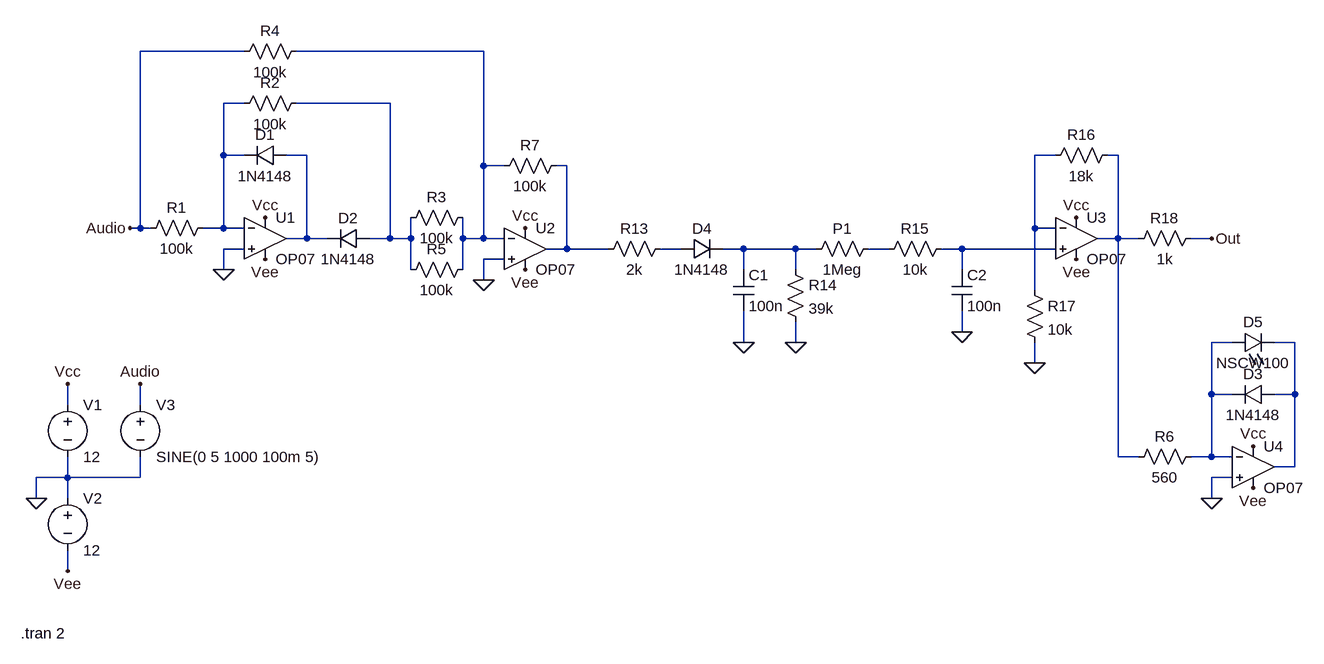
[diagram p0: schematic Envelope Follower.asc]
Envelope Follower.asc, the LTspice schematic file:
Version 4
SHEET 1 2524 680
WIRE 240 -480 80 -480
WIRE 608 -480 320 -480
WIRE 240 -400 208 -400
WIRE 464 -400 320 -400
WIRE 208 -320 208 -400
WIRE 240 -320 208 -320
WIRE 336 -320 304 -320
WIRE 1488 -320 1456 -320
WIRE 1584 -320 1568 -320
WIRE 608 -304 608 -480
WIRE 640 -304 608 -304
WIRE 736 -304 720 -304
WIRE 80 -208 80 -480
WIRE 80 -208 64 -208
WIRE 96 -208 80 -208
WIRE 208 -208 208 -320
WIRE 208 -208 176 -208
WIRE 240 -208 208 -208
WIRE 1456 -208 1456 -320
WIRE 1488 -208 1456 -208
WIRE 336 -192 336 -320
WIRE 336 -192 304 -192
WIRE 368 -192 336 -192
WIRE 464 -192 464 -400
WIRE 464 -192 432 -192
WIRE 496 -192 496 -224
WIRE 496 -192 464 -192
WIRE 576 -192 576 -224
WIRE 608 -192 608 -304
WIRE 608 -192 576 -192
WIRE 640 -192 608 -192
WIRE 1584 -192 1584 -320
WIRE 1584 -192 1552 -192
WIRE 1616 -192 1584 -192
WIRE 1728 -192 1696 -192
WIRE 240 -176 208 -176
WIRE 736 -176 736 -304
WIRE 736 -176 704 -176
WIRE 800 -176 736 -176
WIRE 912 -176 880 -176
WIRE 1008 -176 976 -176
WIRE 1088 -176 1008 -176
WIRE 1120 -176 1088 -176
WIRE 1232 -176 1200 -176
WIRE 1344 -176 1312 -176
WIRE 1488 -176 1344 -176
WIRE 640 -160 608 -160
WIRE 208 -144 208 -176
WIRE 496 -144 496 -192
WIRE 576 -144 576 -192
WIRE 1008 -144 1008 -176
WIRE 1088 -144 1088 -176
WIRE 1344 -144 1344 -176
WIRE 608 -128 608 -160
WIRE 1456 -112 1456 -208
WIRE 1344 -48 1344 -80
WIRE 1008 -32 1008 -80
WIRE 1088 -32 1088 -64
WIRE 1760 -32 1728 -32
WIRE 1856 -32 1824 -32
WIRE 1456 0 1456 -32
WIRE 1728 48 1728 -32
WIRE 1760 48 1728 48
WIRE 1856 48 1856 -32
WIRE 1856 48 1824 48
WIRE -32 64 -32 32
WIRE 80 64 80 32
WIRE 1584 144 1584 -192
WIRE 1616 144 1584 144
WIRE 1728 144 1728 48
WIRE 1728 144 1696 144
WIRE 1760 144 1728 144
WIRE 1856 160 1856 48
WIRE 1856 160 1824 160
WIRE -32 176 -32 144
WIRE -32 176 -80 176
WIRE 80 176 80 144
WIRE 80 176 -32 176
WIRE 1760 176 1728 176
WIRE -80 208 -80 176
WIRE -32 208 -32 176
WIRE 1728 208 1728 176
WIRE -32 320 -32 288
FLAG -32 320 Vee
FLAG -32 32 Vcc
FLAG -80 208 0
FLAG 80 32 Audio
FLAG 64 -208 Audio
FLAG 1728 -192 Out
FLAG 1008 -32 0
FLAG 1088 -32 0
FLAG 1520 -224 Vcc
FLAG 1520 -160 Vee
FLAG 1456 0 0
FLAG 272 -224 Vcc
FLAG 272 -160 Vee
FLAG 208 -144 0
FLAG 672 -208 Vcc
FLAG 672 -144 Vee
FLAG 608 -128 0
FLAG 1344 -48 0
FLAG 1792 128 Vcc
FLAG 1792 192 Vee
FLAG 1728 208 0
SYMBOL voltage -32 48 R0
SYMATTR InstName V1
SYMATTR Value 12
SYMBOL voltage -32 192 R0
SYMATTR InstName V2
SYMATTR Value 12
SYMBOL voltage 80 48 R0
WINDOW 123 0 0 Left 0
WINDOW 39 0 0 Left 0
SYMATTR InstName V3
SYMATTR Value SINE(0 5 1000 100m 5)
SYMBOL res 192 -224 R90
WINDOW 0 0 56 VBottom 2
WINDOW 3 32 56 VTop 2
SYMATTR InstName R1
SYMATTR Value 100k
SYMBOL res 896 -192 R90
WINDOW 0 0 56 VBottom 2
WINDOW 3 32 56 VTop 2
SYMATTR InstName R13
SYMATTR Value 2k
SYMBOL diode 912 -192 M90
WINDOW 0 0 32 VBottom 2
WINDOW 3 32 32 VTop 2
SYMATTR InstName D4
SYMATTR Value 1N4148
SYMBOL cap 992 -144 R0
SYMATTR InstName C1
SYMATTR Value 100n
SYMBOL res 1072 -160 R0
SYMATTR InstName R14
SYMATTR Value 39k
SYMBOL res 1216 -192 R90
WINDOW 0 0 56 VBottom 2
WINDOW 3 32 56 VTop 2
SYMATTR InstName P1
SYMATTR Value 1Meg
SYMBOL res 1328 -192 R90
WINDOW 0 0 56 VBottom 2
WINDOW 3 32 56 VTop 2
SYMATTR InstName R15
SYMATTR Value 10k
SYMBOL cap 1328 -144 R0
SYMATTR InstName C2
SYMATTR Value 100n
SYMBOL res 1584 -336 R90
WINDOW 0 0 56 VBottom 2
WINDOW 3 32 56 VTop 2
SYMATTR InstName R16
SYMATTR Value 18k
SYMBOL res 1440 -128 R0
SYMATTR InstName R17
SYMATTR Value 10k
SYMBOL res 1712 -208 R90
WINDOW 0 0 56 VBottom 2
WINDOW 3 32 56 VTop 2
SYMATTR InstName R18
SYMATTR Value 1k
SYMBOL diode 304 -304 M270
WINDOW 0 32 32 VTop 2
WINDOW 3 0 32 VBottom 2
SYMATTR InstName D1
SYMATTR Value 1N4148
SYMBOL res 336 -416 R90
WINDOW 0 0 56 VBottom 2
WINDOW 3 32 56 VTop 2
SYMATTR InstName R2
SYMATTR Value 100k
SYMBOL diode 432 -176 M270
WINDOW 0 32 32 VTop 2
WINDOW 3 0 32 VBottom 2
SYMATTR InstName D2
SYMATTR Value 1N4148
SYMBOL res 336 -496 R90
WINDOW 0 0 56 VBottom 2
WINDOW 3 32 56 VTop 2
SYMATTR InstName R4
SYMATTR Value 100k
SYMBOL res 592 -240 R90
WINDOW 0 0 56 VBottom 2
WINDOW 3 32 56 VTop 2
SYMATTR InstName R3
SYMATTR Value 100k
SYMBOL res 592 -160 R90
WINDOW 0 0 56 VBottom 2
WINDOW 3 32 56 VTop 2
SYMATTR InstName R5
SYMATTR Value 100k
SYMBOL res 736 -320 R90
WINDOW 0 0 56 VBottom 2
WINDOW 3 32 56 VTop 2
SYMATTR InstName R7
SYMATTR Value 100k
SYMBOL Opamps\\OP07 1520 -256 R0
SYMATTR InstName U3
SYMBOL Opamps\\OP07 272 -256 R0
SYMATTR InstName U1
SYMBOL Opamps\\OP07 672 -240 R0
SYMATTR InstName U2
SYMBOL res 1712 128 R90
WINDOW 0 0 56 VBottom 2
WINDOW 3 32 56 VTop 2
SYMATTR InstName R6
SYMATTR Value 560
SYMBOL Opamps\\OP07 1792 96 R0
SYMATTR InstName U4
SYMBOL diode 1824 32 R90
WINDOW 0 0 32 VBottom 2
WINDOW 3 32 32 VTop 2
SYMATTR InstName D3
SYMATTR Value 1N4148
SYMBOL LED 1760 -16 R270
WINDOW 0 32 32 VTop 2
WINDOW 3 0 32 VBottom 2
SYMATTR InstName D5
SYMATTR Value NSCW100
SYMATTR Description Diode
SYMATTR Type diode
TEXT -104 416 Left 2 !.tran 2

The netlist it stands for:
* Envelope Follower.asc
V1 Vcc 0 12
V2 0 Vee 12
V3 Audio 0 SINE(0 5 1000 100m 5)
R1 N002 Audio 100k
R13 N008 N007 2k
D4 N008 N009 1N4148
C1 N009 0 100n
R14 N009 0 39k
R§P1 N010 N009 1Meg
R15 N011 N010 10k
C2 N011 0 100n
R16 N006 N005 18k
R17 N005 0 10k
R18 Out N006 1k
D1 N004 N002 1N4148
R2 N003 N002 100k
D2 N003 N004 1N4148
R4 N001 Audio 100k
R3 N001 N003 100k
R5 N001 N003 100k
R7 N007 N001 100k
XU3 N011 N005 Vcc Vee N006 LT1001  ; OP07, pins In+ In- V+ V- OUT
XU1 0 N002 Vcc Vee N004 LT1001  ; OP07, pins In+ In- V+ V- OUT
XU2 0 N001 Vcc Vee N007 LT1001  ; OP07, pins In+ In- V+ V- OUT
R6 N012 N006 560
XU4 0 N012 Vcc Vee N013 LT1001  ; OP07, pins In+ In- V+ V- OUT
D3 N013 N012 1N4148
D5 N012 N013 NSCW100
.model D D
.lib standard.dio
.tran 2
.lib LTC.lib
.backanno
.end